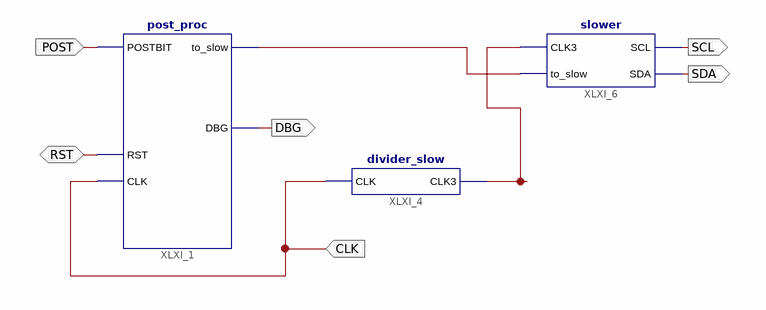
[diagram p0: schematic sheet 1]
// Xilinx ISE schematic overall.sch (xbr) as structural Verilog: 3 symbols, 6 ports
module overall (
  input  POST,
  input  CLK,
  inout  RST,
  output DBG,
  output SCL,
  output SDA
);

  wire XLXN_37, XLXN_55;

  post_proc XLXI_1 (.POSTBIT(POST), .CLK(CLK), .RST(RST), .to_slow(XLXN_37), .DBG(DBG));
  divider_slow XLXI_4 (.CLK(CLK), .CLK3(XLXN_55));
  slower XLXI_6 (.CLK3(XLXN_55), .to_slow(XLXN_37), .SCL(SCL), .SDA(SDA));
endmodule
